# Altium project Sync_Buck_DC-DC_24V.PrjPcb
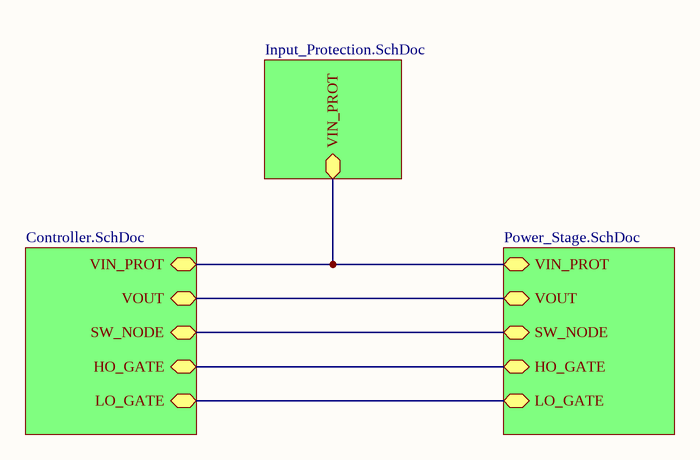
[diagram p0: Top.SchDoc]
4 sheets, 48 parts. Net scope: hierarchical (ports join the sheet entries above them; power ports are global).
Board file: Sync_Buck_DC-DC_24V_PCB.PcbDoc
Sheets:
  Top.SchDoc
     = Input_Protection.SchDoc
     = Power_Stage.SchDoc
     = Controller.SchDoc

## Sheet Top.SchDoc
size A; SheetNumber: 1; SheetTotal: 4

### Sub-sheets
? = Input_Protection.SchDoc: VIN_PROT (bidir)
? = Power_Stage.SchDoc: VIN_PROT (bidir), VOUT (bidir), SW_NODE (bidir), HO_GATE (bidir), LO_GATE (bidir)
? = Controller.SchDoc: VIN_PROT (bidir), VOUT (bidir), SW_NODE (bidir), HO_GATE (bidir), LO_GATE (bidir)

### Nets
NetCboot_2: sheet /SW_NODE, sheet /SW_NODE
NetCc3_2: sheet /VOUT, sheet /VOUT
NetCin_Bulk_1: sheet /VIN_PROT, sheet /VIN_PROT, sheet /VIN_PROT
NetQ1_4: sheet /HO_GATE, sheet /HO_GATE
NetQ2_4: sheet /LO_GATE, sheet /LO_GATE

## Sheet Input_Protection.SchDoc
size A; SheetNumber: 2; SheetTotal: 4
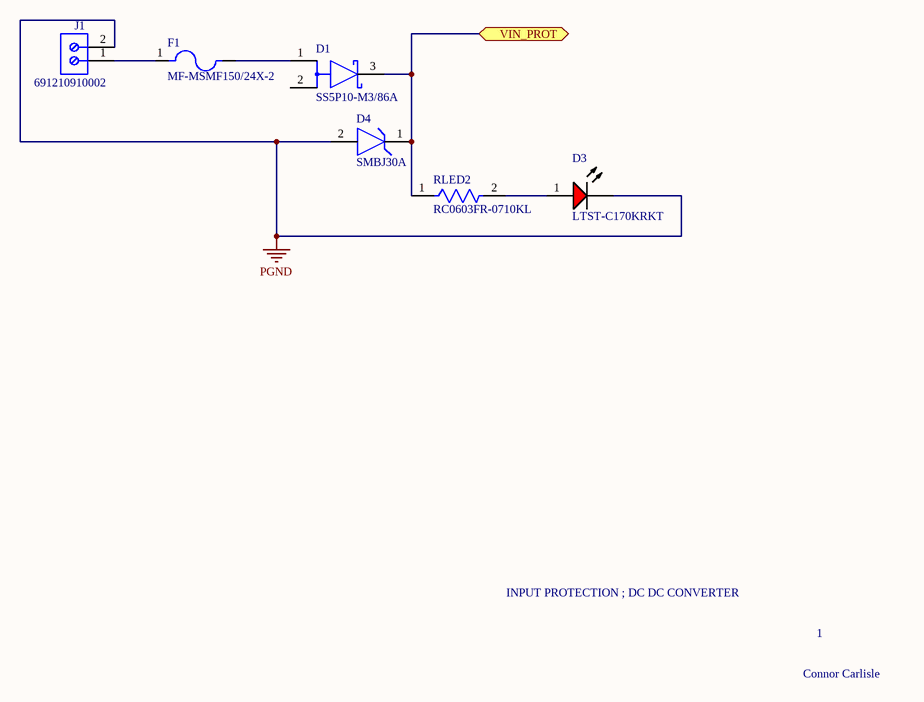
[diagram p1: Input_Protection.SchDoc]

### Parts
D1  SS5P10-M3/86A  [FP-95570-MFG]
D3  LTST-C170KRKT  [LTST-C170KRKT_V]
D4  SMBJ30A  [FP-DO-214AA_SMB_J-Bend-MFG]
F1  MF-MSMF150/24X-2  [FUSER_MF-MSMF150/24X-2]
J1  691210910002  [691210910002]
RLED2  RC0603FR-0710KL  [FP-RC0603-0_55-IPC_C]

### Ports
VIN_PROT (bidir, see Top[2B], Controller[1A], Controller[1C], Controller[4C], Power_Stage[1B])

### Nets
PGND: D3.2(K) D4.2(A) J1.2
NetCin_Bulk_1: D1.3(C) D4.1(C) RLED2.1 ; port VIN_PROT
NetD1_1: D1.1(A) F1.2
NetD3_1: D3.1(A) RLED2.2
NetF1_1: F1.1 J1.1

Not connected (* = marked no-connect by the designer): D1 2(A)

### Notes on the sheet
- INPUT PROTECTION ; DC DC CONVERTER
- 1
- Connor Carlisle

### Library data of the parts
D1 = CMP-02539-000057-1: DIODE SCHOTTKY 100V 5A TO277A; Max Forward Surge Current (Ifsm): 150A; Element Configuration: Common Cathode; Max Reverse Leakage Current: 15uA; Forward Voltage: 880mV; Case/Package: TO-277A; Number of Pins: 3; Max Reverse Voltage (DC): 100V; Height: 0.031inch; Peak Non-Repetitive Surge Current: 150A; Series: eSMP®; Radiation Hardening: No; Length: 0.242inch; Max Repetitive Reverse Voltage (Vrrm): 100V; Forward Current: 5A; Width: 0.171inch; Min Operating Temperature: -55°C; Max Surge Current: 150A; Lead Free: Lead Free; RoHS Compliant: Yes; Average Rectified Current: 5A; Max Operating Temperature: 150°C; Max Reverse Current: 15uA; Package Quantity: 1500; Packaging: Tape and Reel; Mount: Surface Mount
D3 = CMP-2000-07593-1: LED Red, 75 mW, 54 mcd, -55 to 85 degC, 2-Pin SMD, RoHS, Tape and Reel; Manufacturer: Lite-On; Lens Transparency: Clear; Number of Elements: 1; Power Rating: 75mW; Luminous Intensity: 54mcd; Viewing Angle: 130degrees; Forward Current: 30mA; Wavelength: 639nm; Lens Style: Rectangular; Case\/Package: 0805; Test Current: 20mA; Dominant Wavelength: 631nm; Forward Voltage: 2V; Lens Colour: Colorless; Min Operating Temperature: -55degC; RoHSCompliant: True; Length: 3.2mm; Width: 1.25mm; Mount: SurfaceMount; Packaging: TapeandReel; Number of LEDs: 1; Radiation Hardening: No; Datasheet URL: http://optoelectronics.liteon.com/upload/download/DS-22-99-0150/LTST-C170KRKT.pdf; Datasheet Version: Rev. D, 11/2014; Case Code (Metric): 2012; Height: 1.1mm; Number of Pins: 2; Package Description: 2-Pin Surface Mount Device, Body 2 x 1.25 mm; Manufacturer URL: http://www.us.liteon.com/; Lead Free: LeadFree; Illumination Colour: Red; Colour: Red; Case Code (Imperial): 0805; Max Operating Temperature: 85degC; Power Dissipation: 75mW; Mounting Technology: SurfaceMount; Package Reference: C170KRKT; Package Quantity: 1; Depth: 1.6mm
D4 = CMP-00227-00050034-1: SMBJ30A SMBJ Series 48.4 V 0.6 kW Surface Mount Uni-Directional TVS Diode - DO-214AA; NexarPartId: 50034; Manufacturer Package Identifier: DO-214AA (SMB J-Bend); Max Power Dissipation: 5W; Number of Channels: 1; Leakage Current: 1µA; Reverse Breakdown Voltage: 33.3V; Test Current: 1mA; Reverse Voltage: 30V; Element Configuration: Single; Max Breakdown Voltage: 36.8V; Max Surge Current: 12.4A; Polarity: Unidirectional; Power Rating: 600W; Current: 62A; Max Junction Temperature (Tj): 150°C; Power Line Protection: No; Clamping Voltage: 48.4V; Composition: Zener; Number of Elements: 1; Length: 4.57mm; Operating Supply Voltage: 30V; Case/Package: SMB; Number of Pins: 2; Voltage Rating (DC): 30V; Min Operating Temperature: -65°C; Number of Unidirectional Channels: 1; Height: 2.237mm; Lifecycle Status: Production; REACH SVHC: No SVHC; Max Reverse Leakage Current: 1µA; Power Dissipation: 600W; Direction: Unidirectional; Mount: Surface Mount; RoHS: Compliant; Reverse Standoff Voltage: 30V; Schedule B: 8541100080, 8541100080; Termination: SMD/SMT; Max Operating Temperature: 150°C; Packaging: Tape & Reel; Peak Pulse Current: 12.4A; Min Breakdown Voltage: 33.3V; Width: 3.94mm; Lead Free: Lead Free; Peak Pulse Power: 600W; Voltage: 30V; Radiation Hardening: No; Breakdown Voltage: 33.3V
F1 = CMP-005-00016-1: Polymeric PTC Resettable Fuse 24V 1.5 A Ih Surface Mount 1812 (4532 Metric), Concave; MF: Bourns; Design Item ID: MF-MSMF150/24X-2; Digi-Key_Part_Number: MF-MSMF150/24X-2TR-ND; MP: MF-MSMF150/24X-2; Check_prices: https://www.snapeda.com/parts/MF-MSMF150/24X-2/Bourns/view-part/?ref=eda; SnapEDA_Link: https://www.snapeda.com/parts/MF-MSMF150/24X-2/Bourns/view-part/?ref=snap; Source: MF-MSMF150_24X-2.SchLib; Component Type: Standard; Purchase-URL: https://pricing.snapeda.com/search/part/MF-MSMF150/24X-2/?ref=eda; Value: *; Case/Package: 1812 Bourns; Pins: 2
J1 = CMP-1502-02456-3: Tb, Wire To Brd, R/A, 2Way, 18Awg Rohs Compliant: Yes; Voltage Rating: 150V; Number of Contacts: 2; Current Rating: 6A; RoHS: Compliant; Number of Rows: 1; Max Operating Temperature: 105°C; Height: 8.7mm; Contact Material: Tin; Min Operating Temperature: -40°C
RLED2 = CMP-2100-03664-2: RES 10K OHM 1% 1/10W 0603; Voltage Rating: 75V; Voltage Rating (DC): 50V; Resistance: 10kR; Power Rating: 100mW; Temperature Coefficient: 100ppm/°C; Depth: 0.8mm; Termination: SMD/SMT; Resistor Type: Thick Film; Series: RC; Construction: Rectangular; Features: Moisture Resistant; Packaging: Tape and Reel; Min Operating Temperature: -55°C; Number of Terminations: 2; Lead Pitch: 0.3mm; RoHS Compliant: Yes; Case/Package: 0603; Resistance Tolerance: 1%; Military Standard: Not; Weight: 7.1E-05oz; Number of Pins: 2; Tolerance: 1%; Length: 1.6mm; Case Code (Imperial): 0603; Lead Free: Lead Free; Width: 0.8mm; Max Power Dissipation: 100mW; Height: 0.45mm; Max Operating Temperature: 155°C; Case Code (Metric): 1608; Size Code: 0603

## Sheet Power_Stage.SchDoc
size A; SheetNumber: 3; SheetTotal: 4
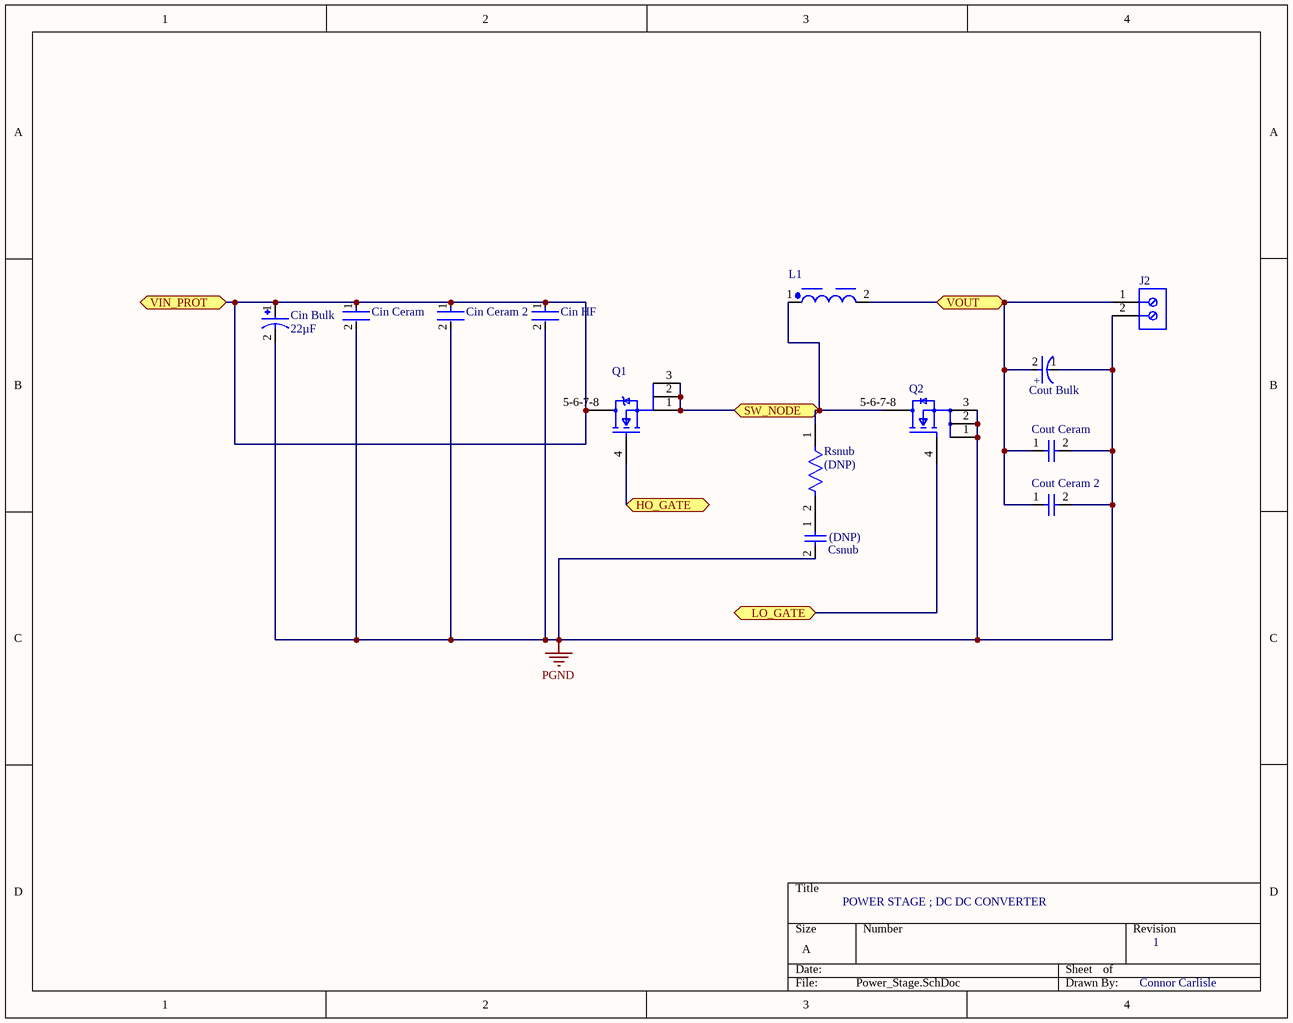
[diagram p2: Power_Stage.SchDoc]

### Parts
Cin_Bulk  value 22µF  [CAP_EEHZA1H220V]  (hidden comment: EEHZA1H220V)
Cin_Ceram  GRM32ER71H475KA88L  [FP-GRM32-MFG]  (value not drawn)
Cin_Ceram_2  GRM32ER71H475KA88L  [FP-GRM32-MFG]  (value not drawn)
Cin_HF  GRM188R72A104KA35D  [FP-GRM188-0_1-e0_2_0_5-IPC_B]  (value not drawn)
Cout_Bulk  16SVPG47M  [FP-OS-CON-SMT-B45-MFG]  (value not drawn)
Cout_Ceram  GRM32ER71C226KE18L  [CAPC3225X270X30LL30]  (value not drawn)
Cout_Ceram_2  GRM32ER71C226KE18L  [CAPC3225X270X30LL30]  (value not drawn)
Csnub  (DNP)  [CAPC1608X90X35NL10T15]
J2  691210910002  [691210910002]  (value not drawn)
L1  74437349100  [WE-LHMI_7050]  (value not drawn)
Q1  CSD18563Q5A  [FP-DQJ0008A-MFG]  (value not drawn)
Q2  CSD18531Q5AT  [FP-DQJ0008A-MFG]  (value not drawn)
Rsnub  (DNP)  [FP-RC0603-0_55-IPC_A]

### Ports
HO_GATE (bidir, see Top[3C], Controller[3B]), LO_GATE (bidir, see Top[3C], Controller[3B]), SW_NODE (bidir, see Top[3C], Controller[1C], Controller[3B], Controller[4C]), VIN_PROT (bidir, see Top[3B], Controller[1A], Controller[1C], Controller[4C], Input_Protection[3B]), VOUT (bidir, see Top[3C], Controller[1B], Controller[2C], Controller[4C])

### Nets
PGND: Cin_Bulk.2 Cin_Ceram.2 Cin_Ceram_2.2 Cin_HF.2 Cout_Bulk.1(C) Cout_Ceram.2 Cout_Ceram_2.2 Csnub.2 J2.2 Q2.1(S) Q2.2(S) Q2.3(S)
NetCboot_2: L1.1 Q1.1(S) Q1.2(S) Q1.3(S) Q2.5-6-7-8(D) Rsnub.1 ; port SW_NODE
NetCc3_2: Cout_Bulk.2(A) Cout_Ceram.1 Cout_Ceram_2.1 J2.1 L1.2 ; port VOUT
NetCin_Bulk_1: Cin_Bulk.1 Cin_Ceram.1 Cin_Ceram_2.1 Cin_HF.1 Q1.5-6-7-8(D) ; port VIN_PROT
NetCsnub_1: Csnub.1 Rsnub.2
NetQ1_4: Q1.4(G) ; port HO_GATE
NetQ2_4: Q2.4(G) ; port LO_GATE

### Notes on the sheet
- POWER STAGE ; DC DC CONVERTER
- 1
- Connor Carlisle
- (in symbol CMP-05428-000223-1) +

### Library data of the parts
Cin_Bulk = CMP-001-00083-1: Cap Aluminum Polymer Hybrid 22uF 50VDC 20% (6.3 X 6.1mm) SMD 0.08 Ohm 1100mA 10000h 105C Automotive T/R; MF: Panasonic; Pins: 2; MP: EEHZA1H220V; Component Type: Standard; Source: EEHZA1H220V.SchLib; SnapEDA_Link: https://www.snapeda.com/parts/EEHZA1H220V/Panasonic/view-part/?ref=snap; Design Item ID: EEHZA1H220V; Case/Package: RADIAL-2 Panasonic; Check_prices: https://www.snapeda.com/parts/EEHZA1H220V/Panasonic/view-part/?ref=eda
Cin_Ceram Cin_Ceram_2 = CMP-1038-02162-3: CAP CER 4.7UF 50V X7R 1210; Manufacturer: Murata; Tolerance: 10%; Temperature Coefficient: 15%; Lead Free: Yes; Value: 4.7uF; ComponentLink2Description: Datasheet; Capacitance: 4.7uF; Digikey Description: CAP CER 4.7UF 50V X7R 1210; Category: Cap; Automotive: No; ComponentLink2URL: https://search.murata.co.jp/Ceramy/image/img/A01X/G101/ENG/GRM32ER71H475KA88-01A.pdf; Package: GRM32; Device Class L2: Capacitors; Voltage Rating: 50V; Device Class L1: Passive Components; Mouser Description: Capacitor Capacitance tolerance: ±10% Ceramic type: X7R Construction form: 1210 Capacitance: 4.7 µF Rated voltage: 50...; Octopart: https://octopart.com/grm32er71h475ka88l-murata-196576; Temperature: -55°C to +125°C; Temperature Range Low: -55°C; Height: 2.7mm; Manufacturer Part Number: GRM32ER71H475KA88L; Temperature Characteristic: X7R; Temperature Range High: +125°C; RoHS: TRUE; Material: Ceramic; Device Class L3: Ceramic Capacitors
Cin_HF = CMP-1035-02595-8: Chip Multilayer Ceramic Capacitors for General Purpose, 0603, 0.10uF, X7R, 15%, 10%, 100V; Capacitance: 100nF; Voltage Rating (DC): 100V; Material: Ceramic; Packaging: Tape and Reel; Dielectric: X7R; Case Code (Imperial): 0603; Package Quantity: 1; Height: 0.8mm; Weight: 0.000222oz; Min Operating Temperature: -55°C; Depth: 0.8mm; Mount: Surface Mount; Thickness: 0.035inch; Voltage: 100V; REACH SVHC: No SVHC; Case/Package: 0603; Voltage Rating: 100V; Width: 0.8mm; Tolerance: 10%; Lead Free: Lead Free; Case Code (Metric): 1608; Radiation Hardening: No; Max Operating Temperature: 125°C; Termination: SMD/SMT; Length: 1.6mm
Cout_Bulk = CMP-05428-000223-1: CAP ALUM POLY 47UF 20% 16V SMD; Polarity: Polar; ESR (Equivalent Series Resistance): 25mR; Ripple Current: 3.2A; Life (Hours): 5000Hour; RoHS Compliant: Yes; Capacitance: 47uF; Case/Package: Radial; Voltage Rating: 16V; Max Operating Temperature: 105°C; Tolerance: 20%; Voltage Rating (DC): 16V; Mount: Surface Mount; Series: OS-CON™, SVPG; Min Operating Temperature: -55°C; Height - Seated (Max): 0.177inch; Package Quantity: 2500; REACH SVHC: No SVHC; Packaging: Cut Tape
Cout_Ceram Cout_Ceram_2 = CMP-2000-06364-1: Chip Capacitor, 22 uF, +/- 10%, 16 V, -55 to 125 degC, 1210 (3225 Metric), RoHS, Tape and Reel; Manufacturer: Murata; Rated Voltage: 16V; Dielectric: X7R; Capacitance: 22000000pF; Case Size/Dimension: 1210; Datasheet Version: 11/2010; Mounting Technology: SurfaceMount; Package Description: 2-Pin Surface Mount Device, Body 3.2 x 2.5 mm; Manufacturer URL: http://www.murata.com/; Datasheet URL: http://media.digikey.com/pdf/Data%20Sheets/Murata%20PDFs/grm32er71c226ke18.pdf; Package Reference: 1210; Tolerance (%): ±10%
Csnub = CMP-2006-02891-1: Part Number: GRM188R71H102KA01D; Manufacturer: Murata
J2 = CMP-1502-02456-3: as J1 on sheet Input_Protection; RoHS: Compliant; Number of Rows: 1; Max Operating Temperature: 105°C; Height: 8.7mm; Contact Material: Tin; Min Operating Temperature: -40°C
L1 = CMP-1353-00074-7: General Purpose Inductor, 10uH, 20%, 1 Element, Powdered Iron-Core, SMD, 2926; Current Rating: 3.2A; Inductance: 10µH; Test Frequency: 100kHz; Frequency: 12MHz; Saturation Current: 5.6A; DC Resistance (DCR): 65mΩ; Core Material: Composite, Ferrite; Shielding: Shielded; Series Resistance: 69mΩ; Ambient Temperature Range Low: -40°C; Width: 6.6mm; REACH SVHC: Unknown; Height: 4.8mm; Termination: SMD/SMT; Depth: 6.6mm; Composition: Wirewound; Inductance Tolerance: 20%; RoHS: Compliant; Tolerance: 20%; Max DC Current: 3.2A; Height - Seated (Max): 5.0038mm; Length: 7.3mm; Ambient Temperature Range High: 85°C; Min Operating Temperature: -40°C; Mount: Surface Mount; Case/Package: Nonstandard; Lead Free: Lead Free; Max Operating Temperature: 125°C; Self Resonant Frequency: 12MHz; RMS Current (Irms): 3.2A
Q1 = CMP-04962-000004-1: MOSFET N-CH 60V 100A 8SON; Manufacturer: Texas Instruments; Threshold Vgs Max: 2.4V; Number Of Channels: 1; Input Capacitace At Vds: 1150pF @ 30V; Gate Charge At Vgs: 15nC @ 10V; Reverse Recovery Charge: 63nC; Max Junction Temp: +150°C; Max Forward Diode Voltage: 1V; Power Dissipation: 3.2W; Reverse Recovery Time: 49ns; Rthja Max: 50°C/W; Typ Forward Diode Voltage: 0.8V; Turn On Delay Time: 3.2ns; Threshold Vgs Min: 1.7V; Drain To Source Resistance: 5.7mΩ; Turn Off Delay Time: 11.4ns; Transconductance: 60S; Gate To Source Voltage: 20V; Continuous Drain Current: 15A; Package: DQJ0008A; Temperature Range High: +150°C; Device Class L3: MOSFETs; Device Class L2: Transistors; Manufacturer Part Number: CSD18563Q5A; RoHS: TRUE; Number Of N Channels: 1; Automotive: No; Lead Free: Yes; Digikey Description: MOSFET N-CH 60V 100A 8SON; Drain To Source Breakdown Voltage: 60V; Temperature Range Low: -55°C; Temperature: -55°C to +150°C; Category: Trans; Device Class L1: Discrete Semiconductors; Height: 1.1mm; Octopart: https://octopart.com/csd18563q5a-texas+instruments-30331677; ComponentLink2Description: Datasheet; ComponentLink2URL: http://www.ti.com/lit/ds/symlink/csd18563q5a.pdf; Drain To Source Voltage: 60V; Mouser Description: MOSFET 60V N-Channel NexFET Power MOSFET
Q2 = CMP-04962-000084-1: MOSFET N-CH 60V 100A 8VSON; Turn-On Delay Time: 4.4ns; Gate to Source Voltage (Vgs): 20V; Input Capacitance: 3.84nF; Rds On Max: 4.6mR; Element Configuration: Single; Turn-Off Delay Time: 20ns; Fall Time: 2.7ns; Rise Time: 7.8ns; Max Power Dissipation: 3.1W; Resistance: 0.0035R; Continuous Drain Current (ID): 100A; Mount: Surface Mount; Packaging: Tape and Reel; Number of Pins: 8; Contact Plating: Tin; RoHS Compliant: Yes; Min Operating Temperature: -55°C; Max Operating Temperature: 150°C; Drain to Source Voltage (Vdss): 60V; Lead Free: Contains Lead
Rsnub = CMP-03412-037810-1: RES SMD 2.2 OHM 1% 1/10W 0603; Voltage Rating: 50V; Max Power Dissipation: 100mW; Resistance: 2.2R; Temperature Coefficient: 200ppm/°C; Lead Free: Lead Free; Series: RC; Resistor Type: Thick Film; Case Code (Imperial): 0603; Number of Pins: 2; Min Operating Temperature: -55°C; Packaging: Tape and Reel; Length: 0.063inch; Power Rating: 100mW; Features: Moisture Resistant; Resistance Tolerance: 1%; Termination: SMD/SMT; Width: 0.031inch; REACH SVHC: No SVHC; Case Code (Metric): 1608; Height: 0.022inch; Voltage Rating (DC): 50V; Size Code: 0603; Max Operating Temperature: 155°C; Case/Package: 0603; Number of Terminations: 2; Depth: 0.8mm; Tolerance: 1%; RoHS Compliant: Yes; Technology: THICK FILM; Package Quantity: 1

## Sheet Controller.SchDoc
size A; SheetNumber: 4; SheetTotal: 4
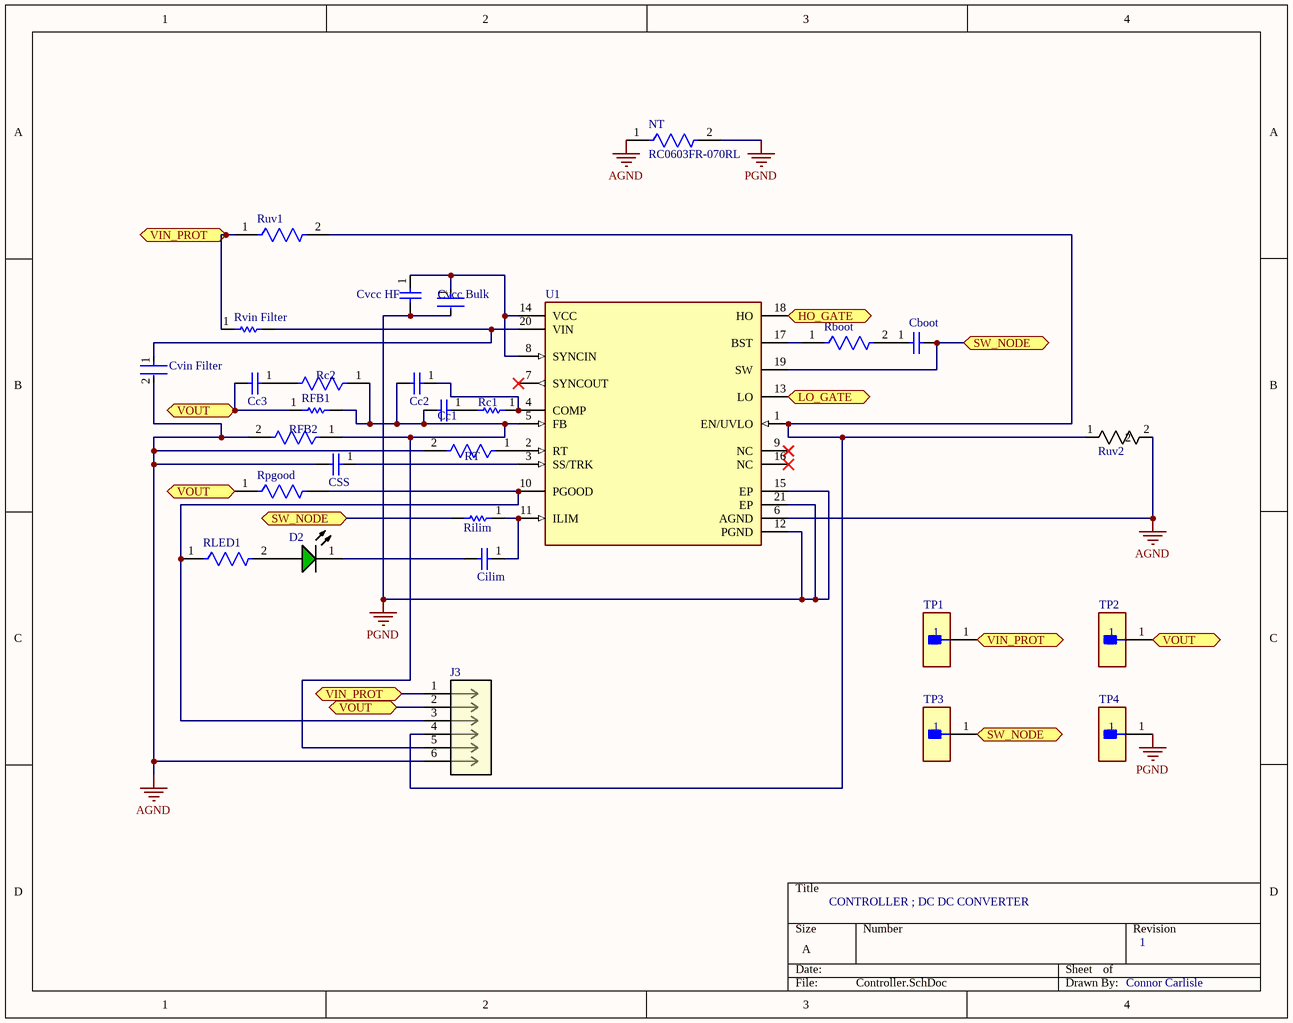
[diagram p3: Controller.SchDoc]

### Parts
Cboot  GRM188R71C104KA01D  [MURA-0603_H_0.9_M]  (value not drawn)
Cc1  GRM188R71H332KA01D  [CAPC1608X90X35LL10T15]  (value not drawn)
Cc2  GRM1885C1H560JA01D  [CAPC1608X90X35NL10T15]  (value not drawn)
Cc3  GRM1885C1H681JA01D  [CAPC1608X90X35ML10T15]  (value not drawn)
Cilim  GRM1885C1H220JA01D  [CAPC1608X90X35ML10T15]  (value not drawn)
CSS  GRM188R71C473KA01D  [CAPC1608X90X35ML10T15]  (value not drawn)
Cvcc_Bulk  GRM188Z71C225KE43D  [FP-GRM188-0_2-MFG]  (value not drawn)
Cvcc_HF  GRM188R71C104KA01D  [MURA-0603_H_0.9_M]  (value not drawn)
Cvin_Filter  GRM188R72A104KA35D  [FP-GRM188-0_1-e0_2_0_5-IPC_B]  (value not drawn)
D2  LTST-C170KGKT  [LTST-LTST-C170KGKT-2_V]  (value not drawn)
J3  PRPC006SAAN-RC  [CONN6_PRPC006SAAN-RC_SUL]  (value not drawn)
NT  RC0603FR-070RL  [FP-RC0603-MFG]
Rboot  RC0603FR-072R2L  [FP-RC0603-0_55-IPC_A]  (value not drawn)
Rc1  RC0603FR-0715KL  [RESC1608X55X25LL10T15]  (value not drawn)
Rc2  RC0603FR-07100RL  [FP-RC0603-0_55-MFG]  (value not drawn)
RFB1  RC0603FR-0752K3L  [RESC1608X55X25LL10T15]  (value not drawn)
RFB2  RC0603FR-0710KL  [FP-RC0603-0_55-IPC_C]  (value not drawn)
Rilim  RC0603FR-07147RL  [RESC1608X55X25NL10T15]  (value not drawn)
RLED1  RC0603FR-071KL  [FP-RC0603-0_55-IPC_C]  (value not drawn)
Rpgood  RC0603FR-07100KL  [FP-RC0603-0_55-MFG]  (value not drawn)
RT  RC0603FR-0720KL  [FP-RC0603-0_55-IPC_C]  (value not drawn)
Ruv1  RC0603FR-07100KL  [FP-RC0603-0_55-MFG]  (value not drawn)
Ruv2  RC0603FR-0717K8L  [RC0603N_YAG]  (value not drawn)
Rvin_Filter  4R7 1% 0603(1608)  [RESC0603(1608)_M]  (value not drawn)
TP1  5015  [FP-5015-MFG]  (value not drawn)
TP2  5015  [FP-5015-MFG]  (value not drawn)
TP3  5015  [FP-5015-MFG]  (value not drawn)
TP4  5015  [FP-5015-MFG]  (value not drawn)
U1  LM5145RGYR  [FP-RGY0020B-MFG]  (value not drawn)

### Ports
HO_GATE (bidir, see Top[2C], Power_Stage[2B]), LO_GATE (bidir, see Top[2C], Power_Stage[3C]), SW_NODE (bidir, see Top[2C], Power_Stage[3B]), VIN_PROT (bidir, see Top[2B], Input_Protection[3B], Power_Stage[1B]), VOUT (bidir, see Top[2C], Power_Stage[3B])

### Nets
AGND: CSS.2 Cvin_Filter.2 J3.6 NT.1 RFB2.2 RT.2 Ruv2.2 U1.6(AGND)
PGND: Cvcc_Bulk.2 Cvcc_HF.2 NT.2 TP4.1 U1.12(PGND) U1.15(EP) U1.21(EP)
NetCboot_1: Cboot.1 Rboot.2
NetCboot_2: Cboot.2 Rilim.2 TP3.1 U1.19(SW) ; port SW_NODE
NetCc1_1: Cc1.1 Rc1.2
NetCc1_2: Cc1.2 Cc2.2 J3.5 Rc2.1 RFB1.2 RFB2.1 U1.5(FB)
NetCc2_1: Cc2.1 Rc1.1 U1.4(COMP)
NetCc3_1: Cc3.1 Rc2.2
NetCc3_2: Cc3.2 J3.2 RFB1.1 Rpgood.1 TP2.1 ; port VOUT
NetCilim_1: Cilim.1 Rilim.1 U1.11(ILIM)
NetCilim_2: Cilim.2 D2.1(K)
NetCin_Bulk_1: J3.1 Ruv1.1 Rvin_Filter.1 TP1.1 ; port VIN_PROT
NetCSS_1: CSS.1 U1.3(SS/TRK)
NetCvcc_Bulk_1: Cvcc_Bulk.1 Cvcc_HF.1 U1.8(SYNCIN) U1.14(VCC)
NetCvin_Filter_1: Cvin_Filter.1 Rvin_Filter.2 U1.20(VIN)
NetD2_2: D2.2(A) RLED1.2
NetJ3_3: J3.3 RLED1.1 Rpgood.2 U1.10(PGOOD)
NetJ3_4: J3.4 Ruv1.2 Ruv2.1 U1.1(EN/UVLO)
NetQ1_4: U1.18(HO) ; port HO_GATE
NetQ2_4: U1.13(LO) ; port LO_GATE
NetRboot_1: Rboot.1 U1.17(BST)
NetRT_1: RT.1 U1.2(RT)

Not connected (* = marked no-connect by the designer): U1 7(SYNCOUT)* 9(NC)* 16(NC)*

### Notes on the sheet
- CONTROLLER ; DC DC CONVERTER
- 1
- Connor Carlisle

### Library data of the parts
Cboot Cvcc_HF = CMP-2000-05253-1: CAP, Ceramic, 0.1 uF, 10%, 16 V, 0603, RoHS, Tape and Reel; Manufacturer: Murata; Capacitance - pF: 100000pF; Case Length: 1.6mm; Voltage Rating DC: 16V; Brand: MurataElectronics; Temperature Coefficient / Code: +/-15%; Case Width: 0.8mm; Capacitance: 0.1uF; Dielectric: X7R; Capacitance - nF: 100nF; Product Category: MultilayerCeramicCapacitorsMLCC-SMD/SMT; Datasheet URL: https://datasheet.ciiva.com/29202/451467-da-01-en-vs-kondensator-0603-29202287.pdf; Termination Style: SMD/SMT; Operating Temperature Range: -55Cto+125C; Case Code - in: 0603; Datasheet Version: Dec-10; Dimensions: 0.8mmWx1.6mmLx0.8mmH; RoHS: Details; Case Code - mm: 1608; Product: GeneralTypeMLCCs; Voltage Rating: 16V; Package / Case: 0603(1608metric); Factory Pack Quantity: 4000; Packaging: Reel; Maximum Operating Temperature: +125C; Manufacturer URL: http://www.murata.com/; Type: GeneralPurposeMLCC; Case Height: 0.8mm; Minimum Operating Temperature: -55C; Series: GRM; Tolerance: 10%
Cc1 = CMP-2006-02916-1: Manufacturer: Murata; Part Number: GRM188R71H332KA01D
Cc2 = CMP-2006-02680-1: Manufacturer: Murata; Part Number: GRM1885C1H560JA01D
Cc3 = CMP-2006-02690-1: Manufacturer: Murata; Part Number: GRM1885C1H681JA01D
Cilim = CMP-2000-04945-1: Chip Capacitor, 22 pF, +/- 5%, 50 V, -55 to 125 degC, 0603 (1608 Metric), RoHS, Tape and Reel; Manufacturer: Murata; Capacitance: 22pF; Rated Voltage: 50V; Dielectric: C0G; Manufacturer URL: http://www.murata.com/; Datasheet Version: Jul-06; Package Reference: 603; Tolerance (%): ±5%; Case Size/Dimension: 0603; Package Description: 2-Pin Surface Mount Device, Body 1.6 x 0.8 mm; Datasheet URL: https://datasheet.ciiva.com/11786/0900766b807a1cab-11786398.pdf
CSS = CMP-2006-02858-1: Manufacturer: Murata; Part Number: GRM188R71C473KA01D
Cvcc_Bulk = CMP-06035-057307-1: Chip Multilayer Ceramic Capacitors for General Purpose, 0603, 2.2uF, X7R, 15%, 10%, 16V; Case/Package: 0603
Cvin_Filter = CMP-1035-02595-8: as Cin_HF on sheet Power_Stage; Voltage Rating (DC): 100V; Material: Ceramic; Packaging: Tape and Reel; Dielectric: X7R; Case Code (Imperial): 0603; Package Quantity: 1; Height: 0.8mm; Weight: 0.000222oz; Min Operating Temperature: -55°C; Depth: 0.8mm; Mount: Surface Mount; Thickness: 0.035inch; Voltage: 100V; REACH SVHC: No SVHC; Case/Package: 0603; Voltage Rating: 100V; Width: 0.8mm; Tolerance: 10%; Lead Free: Lead Free; Case Code (Metric): 1608; Radiation Hardening: No; Max Operating Temperature: 125°C; Termination: SMD/SMT; Length: 1.6mm
D2 = CMP-2000-06620-1: Ultra Bright AlInGaP Chip LED, 75 mW, -55 to 85 degC, 2-Pin SMD (0805), RoHS, Tape and Reel; Manufacturer: Lite-On; Forward Current: 30mA; Power Dissipation Max: 75mW; Emitting Color: YellowGreen; Type: Uni-Color; Forward Voltage: 2.4V; Dominant Wave Length: 571nm; Test Current (It): 20mA; Product Length (mm): 2mm; Peak Wavelength: 574nm; Power Dissipation: 75W; Product Depth (mm): 1.25mm; DELETED: Compliant; High Brightness: Yes; Product Height (mm): 1.1mm; Luminous Intensity: 35mcd; Shape Type: Rectangular; Chip Material: AlGaInP; Viewing Angle: 130deg; Number of  Elements: 1; Reverse Voltage: 5V; Rad Hardened: No; Package Type: ChipLed; Manufacturer URL: http://www.us.liteon.com/; Mounting: SurfaceMount; Operating Temp Range: -55Cto85C; Datasheet URL: http://optoelectronics.liteon.com/upload/download/DS22-2000-073/S_110_LTST-C170KGKT.pdf; Packaging: TapeandReel; Pin Count: 2; Package Description: 2-Pin Surface Mounted Device, Body 2 x 1.25 mm; Mounting Technology: SurfaceMount; Package Reference: LTST-C170KGKT-2; Forward Current Max: 30mA; Datasheet Version: Rev. G, 06/2005; Lens Dimensions: 1.4x1.25x0.6mm; Operating Temperature Classification: Industrial; Lum Intensity: 35mcd; Main Category: ChipLED
J3 = CMP-028-000000-1: Description; Manufacturer_Name: Sullins; Type: Headers, Male Pins; Copyright: Copyright (C) 2025 Ultra Librarian. All rights reserved.; Design Item ID: PRPC006SAAN-RC; RefDes: RefDes; Manufacturer_Part_Number: PRPC006SAAN-RC; Source: PRPC006SAAN-RC.SchLib
NT = CMP-2000-06925-2: RES SMD 0 OHM JUMPER 1/10W 0603; Manufacturer: Yageo; Tolerance: 1%; Value: 0Ω; Power Rating: 0.1W; Voltage Rating: 75V; Composition: Thick Film; Temperature Range Low: -55°C; Ipc Land Pattern Name: RESC16080X45; Lead Free: Yes; Digikey Description: RES SMD 0 OHM JUMPER 1/10W 0603; Height: 0.55mm; Automotive: No; Device Class L3: Chip SMD Resistors; Device Class L1: Passive Components; Device Class L2: Resistors; Footprint Url: http://www.yageo.com/exep/pages/download/literatures/PYu-R_Mount_10.pdf; Category: Res; Mouser Description: RC Series 0603 0.1 W 0 O Jumper Surface Mount Thick Film Chip Resistor; Resistance: 0Ω; ComponentLink2URL: http://www.yageo.com/documents/recent/PYu-RC_Group_51_RoHS_L_10.pdf; Series: RC_L; ComponentLink2Description: Datasheet; RoHS: TRUE; Temperature: -55°C to +155°C; Temperature Range High: +155°C; Package: RC0603; Octopart: https://octopart.com/rc0603fr-070rl-yageo-1180803; Manufacturer Part Number: RC0603FR-070RL
Rboot = CMP-03412-037810-1: as Rsnub on sheet Power_Stage; Lead Free: Lead Free; Series: RC; Resistor Type: Thick Film; Case Code (Imperial): 0603; Number of Pins: 2; Min Operating Temperature: -55°C; Packaging: Tape and Reel; Length: 0.063inch; Power Rating: 100mW; Features: Moisture Resistant; Resistance Tolerance: 1%; Termination: SMD/SMT; Width: 0.031inch; REACH SVHC: No SVHC; Case Code (Metric): 1608; Height: 0.022inch; Voltage Rating (DC): 50V; Size Code: 0603; Max Operating Temperature: 155°C; Case/Package: 0603; Number of Terminations: 2; Depth: 0.8mm; Tolerance: 1%; RoHS Compliant: Yes; Technology: THICK FILM; Package Quantity: 1
Rc1 = CMP-1659-00032-1: Chip Resistor, 15 KOhm, +/- 1%, 0.1 W, -55 to 155 degC, 0603 (1608 Metric), RoHS, Tape and Reel; PackageDescription: 2-Pin Surface Mount Device, Body 1.6 x 0.8 mm; RoHSCompliant: true; ComponentLink2Description: Datasheet; DatasheetVersion: Rev. 4, 02/2016; ComponentLink1Description: Manufacturer URL; ComponentLink1URL: http://www.yageo.com/; PackageReference: 0603; ComponentLink2URL: http://www.yageo.com/documents/recent/PYu-RC_Group_51_RoHS_L_04.pdf
Rc2 = CMP-2100-03663-2: NexarPartId: 55402879; Voltage Rating: 50V; Power Rating: 100mW; Tolerance: 1%; Temperature Coefficient: 100ppm/°C; Resistance: 100Ω; Case/Package: 0603; Military Standard: Not; REACH SVHC: Unknown; Case Code (Metric): 0603; Max Operating Temperature: 155°C; Schedule B: 8533210045, 8533210045; Height: 450µm; Length: 1.6mm; Lead Free: Lead Free; Packaging: Tape & Reel; Case Code (Imperial): 0603; Composition: Thick Film; Min Operating Temperature: -55°C; Voltage Rating (DC): 50V; RoHS: Compliant; Depth: 800µm; Number of Pins: 2; Termination: SMD/SMT; Width: 800µm
RFB1 = CMP-1012-00705-2: Manufacturer: Yageo; Part Number: RC0603FR-0752K3L
RFB2 = CMP-2100-03664-2: as RLED2 on sheet Input_Protection; Depth: 0.8mm; Termination: SMD/SMT; Resistor Type: Thick Film; Series: RC; Construction: Rectangular; Features: Moisture Resistant; Packaging: Tape and Reel; Min Operating Temperature: -55°C; Number of Terminations: 2; Lead Pitch: 0.3mm; RoHS Compliant: Yes; Case/Package: 0603; Resistance Tolerance: 1%; Military Standard: Not; Weight: 7.1E-05oz; Number of Pins: 2; Tolerance: 1%; Length: 1.6mm; Case Code (Imperial): 0603; Lead Free: Lead Free; Width: 0.8mm; Max Power Dissipation: 100mW; Height: 0.45mm; Max Operating Temperature: 155°C; Case Code (Metric): 1608; Size Code: 0603
Rilim = CMP-2000-04904-1: Manufacturer: Yageo; Part Number: RC0603FR-07147RL
RLED1 = CMP-1659-00009-5: RES 1K OHM 1% 1/10W 0603; Resistance: 1kR; Voltage Rating: 50V; Power Rating: 100mW; Temperature Coefficient: 100ppm/°C; Military Standard: Not; REACH SVHC: No SVHC; Size Code: 0603; Features: Moisture Resistant; Number of Terminations: 2; Technology: THICK FILM; Series: RC; Case Code (Metric): 1608; Resistance Tolerance: 1%; Resistor Type: Thick Film; Termination: SMD/SMT; Contact Plating: Tin; Radiation Hardening: No; Min Operating Temperature: -55°C; Max Operating Temperature: 155°C; Packaging: Tape and Reel; Max Power Dissipation: 100mW; RoHS Compliant: Yes; Height: 0.45mm; Lead Free: Lead Free; Case/Package: 0603; Length: 1.6mm; Tolerance: 1%; Case Code (Imperial): 0603; Construction: Rectangular; Depth: 0.8mm
Rpgood Ruv1 = CMP-2100-03662-2: RES SMD 100K OHM 1% 1/10W 0603; Voltage Rating (DC): 50V; Resistance: 100kR; Max Power Dissipation: 100mW; Temperature Coefficient: 100ppm/°C; Working Voltage: 75V; Length: 1.6mm; Lead Free: Lead Free; Number of Terminations: 2; Packaging: Tape and Reel; Voltage Rating: 50V; Termination: SMD/SMT; Width: 0.8mm; Resistor Type: Thick Film; Resistance Tolerance: 1%; Features: Moisture Resistant; Height: 0.45mm; Construction: Rectangular; Case/Package: 0603; Military Standard: Not; Case Code (Imperial): 0603; Series: RC; Technology: THICK FILM; Depth: 0.8mm; RoHS Compliant: Yes; REACH SVHC: No SVHC; Min Operating Temperature: -55°C; Case Code (Metric): 1608; Max Operating Temperature: 155°C; Power Rating: 100mW; Number of Pins: 2; Tolerance: 1%
RT = CMP-2000-06932-2: RES 20K OHM 1% 1/10W 0603; Voltage Rating: 50V; Temperature Coefficient: 100ppm/°C; Power Rating: 100mW; Resistance: 20kR; Height: 0.022inch; REACH SVHC: No SVHC; Case Code (Metric): 1608; Depth: 0.8mm; Tolerance: 1%; Min Operating Temperature: -55°C; Series: RC; RoHS Compliant: Yes; Resistor Type: Thick Film; Max Power Dissipation: 100mW; Features: Moisture Resistant; Max Operating Temperature: 155°C; Package Quantity: 1; Size Code: 0603; Packaging: Tape and Reel; Width: 0.031inch; Length: 0.063inch; Military Standard: Not; Technology: THICK FILM; Number of Terminations: 2; Termination: SMD/SMT; Construction: Rectangular; Case/Package: 0603; Number of Pins: 2; Lead Free: Lead Free; Voltage Rating (DC): 50V; Resistance Tolerance: 1%; Case Code (Imperial): 0603
Ruv2 = CMP-009-00179-1: No Description Available; Manufacturer_Name: Yageo; Manufacturer_Part_Number: RC0603FR-0717K8L; Copyright: Copyright (C) 2026 Ultra Librarian. All rights reserved.; Source: RC0603FR-0717K8L.SchLib; Design Item ID: RC0603FR-0717K8L
Rvin_Filter = CMP-1012-00247-1: 4R7 0.1W 1% 0603 (1608 Metric)  SMD; Case-EIA: 0603; Case-Metric: 1608; Value: 4.70 Ohm; Power: 0.1 W; Technology: SMT; Tolerance: 1 %
TP1-TP4 = CMP-2000-05183-2: PC TEST POINT MINIATURE; Manufacturer: keystone; Number Of Contacts: 1; Conn Orientation: Straight; Category: Conn; Manufacturer Part Number: 5015; Digikey Description: PC TEST POINT MINIATURE; Automotive: No; Lead Free: Yes; Octopart: https://octopart.com/5015-keystone-3822; ComponentLink2URL: http://www.keyelco.com/product-pdf.cfm?p=1353; Package: 5015; RoHS: TRUE; Device Class L3: unset; Device Class L2: unset; Contact Material: Silver; Device Class L1: Connectors; Height: 1.65mm; ComponentLink2Description: Datasheet
U1 = CMP-00024-00006-1: LM5145 Buck Tape & Reel (TR) e3 DC to DC switching controller 1mm 75V 100kHz~1MHz -40C~125C TJ; Nominal Supply Current: 1.8mA; Case/Package: VQFN; Pins: 20; Min Operating Temperature: -40°C; Max Operating Temperature: 125°C

## Nets that join several sheets
PGND: Input_Protection (D3.2 D4.2 J1.2), Power_Stage (12 pins), Controller (7 pins)
NetCboot_2: Power_Stage (6 pins), Controller (Cboot.2 Rilim.2 TP3.1 U1.19)
NetCc3_2: Power_Stage (5 pins), Controller (5 pins)
NetCin_Bulk_1: Input_Protection (D1.3 D4.1 RLED2.1), Power_Stage (5 pins), Controller (J3.1 Ruv1.1 Rvin_Filter.1 TP1.1)
NetQ1_4: Power_Stage (Q1.4), Controller (U1.18)
NetQ2_4: Power_Stage (Q2.4), Controller (U1.13)